# EAGLE design dontlook (EAGLE 5.07)
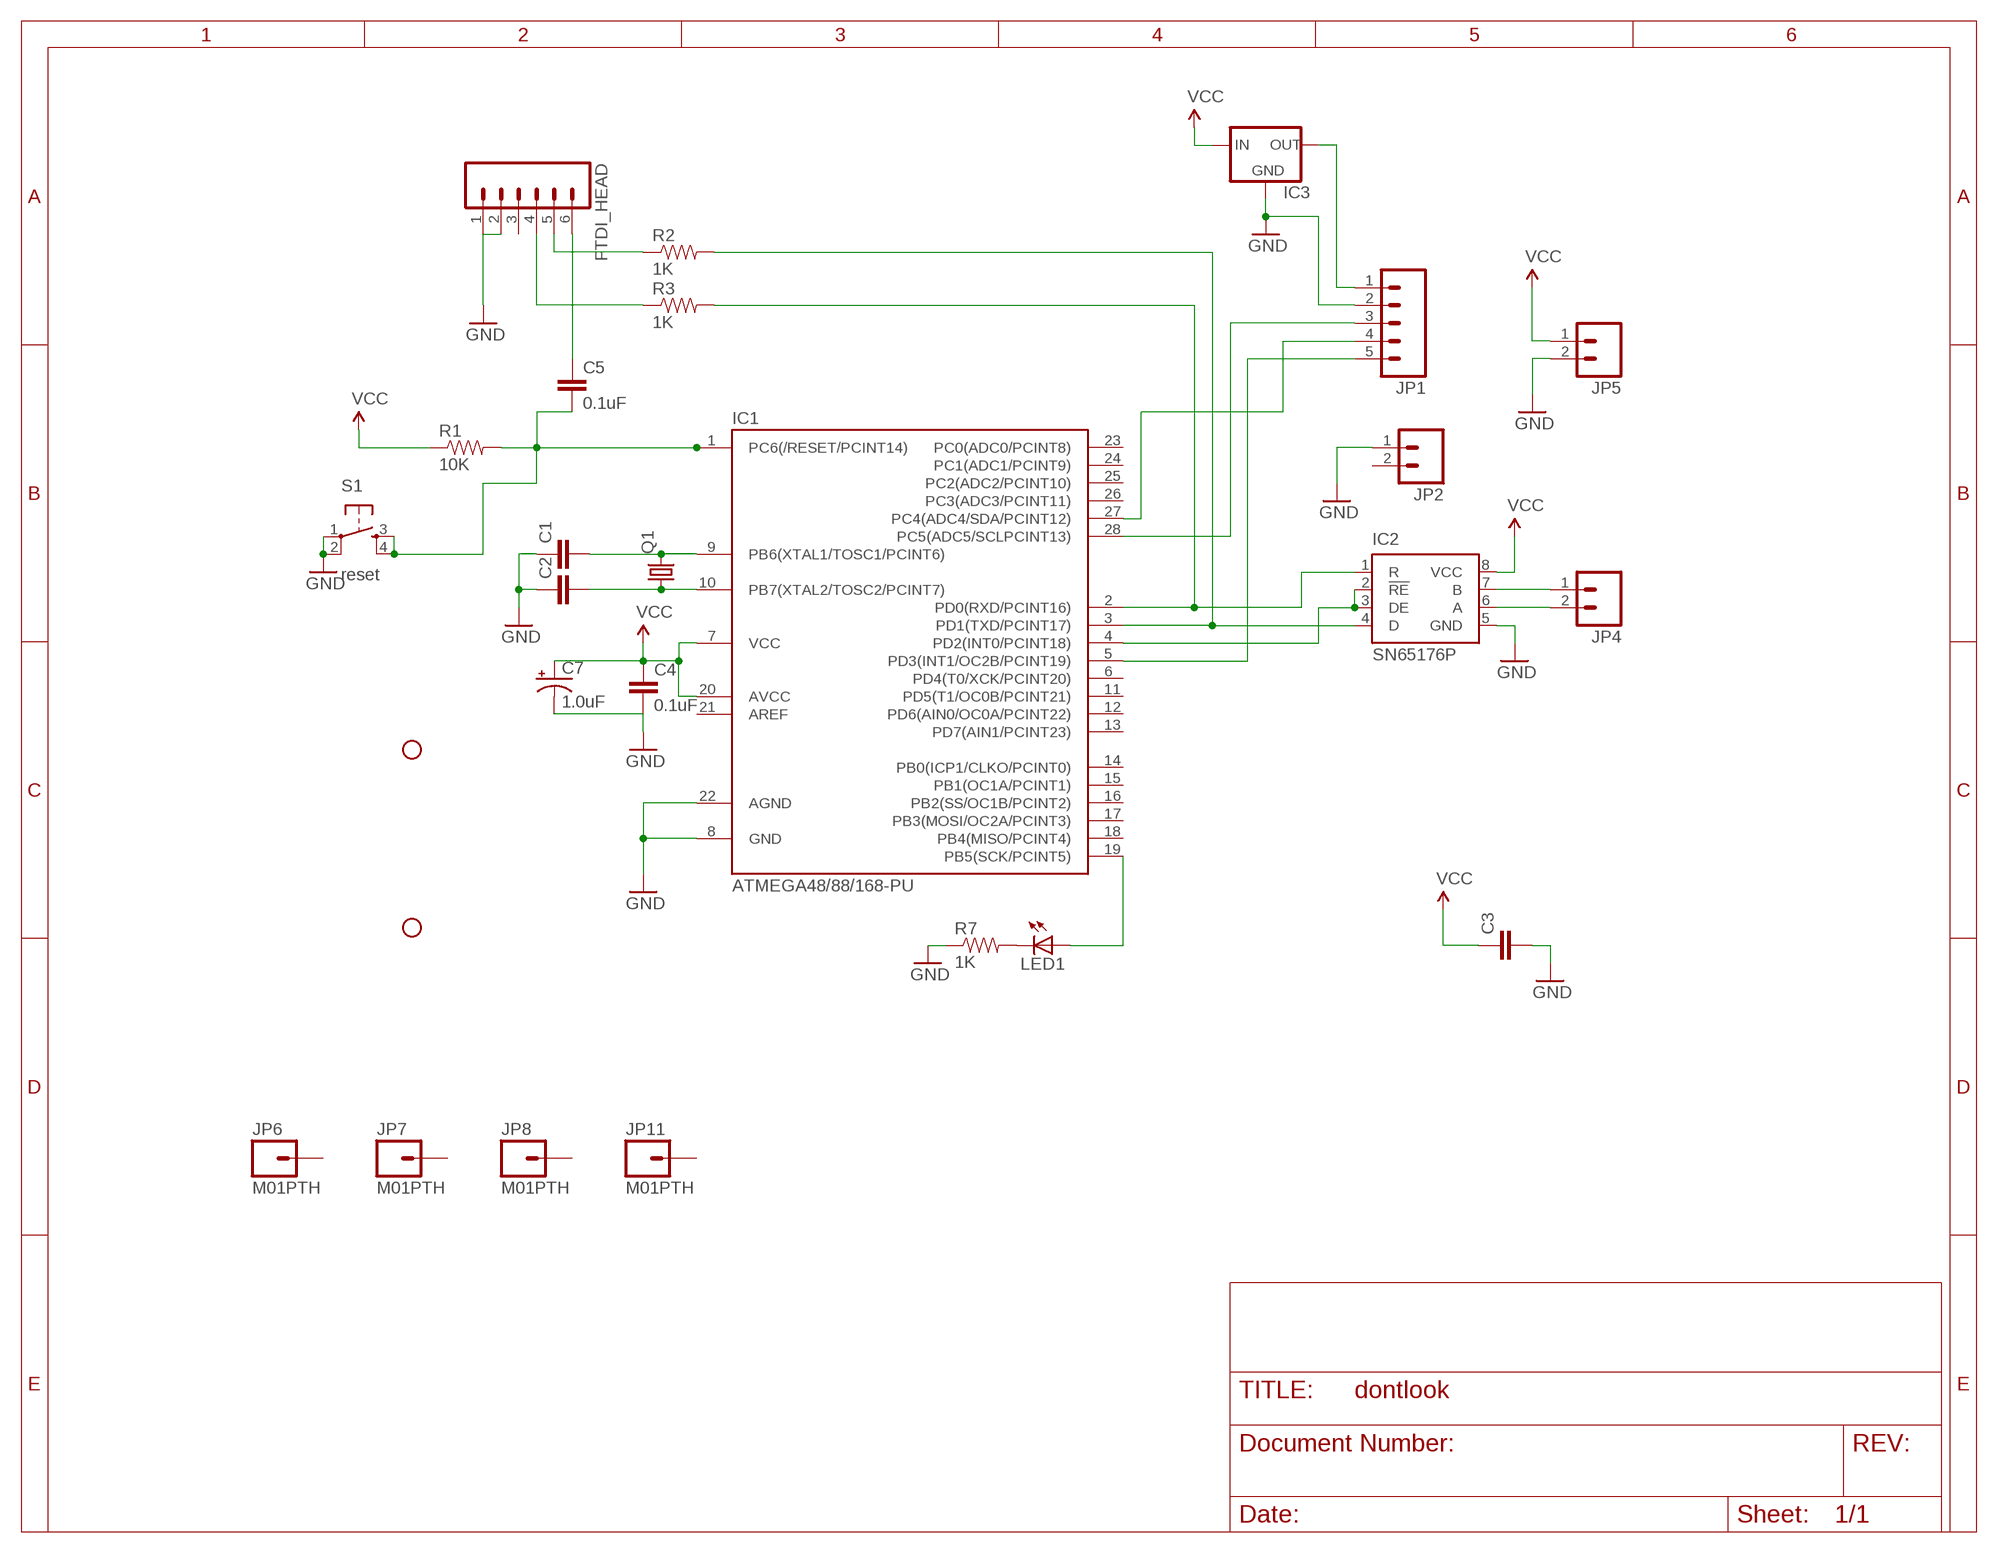
[diagram p0: schematic, sheet 1]

## Parts
C1  CAPPTH  [CAP-PTH-SMALL]
C2  CAPPTH  [CAP-PTH-SMALL]
C3  CAPPTH  [CAP-PTH-SMALL]
C4  0.1uF  CAPPTH  [CAP-PTH-SMALL]
C5  0.1uF  CAPPTH  [CAP-PTH-SMALL]
C7  1.0uF  CAP_POLPTH2  [CPOL-RADIAL-10UF-25V]
FTDI_HEAD  M06LOCK_LONGPADS  [1X06_LOCK_LONGPADS]
IC1  ATMEGA48/88/168-PU  [DIL28-3]
IC2  SN65176P  [DIL08]
IC3  78LXX  [78LXX]
JP1  M05LOCK_LONGPADS  [1X05_LOCK_LONGPADS]
JP2  M02LOCK_LONGPADS  [1X02_LOCK_LONGPADS]
JP4  M02PTH  [1X02]
JP5  M02PTH  [1X02]
JP6  M01PTH  [1X01]
JP7  M01PTH  [1X01]
JP8  M01PTH  [1X01]
JP9  STAND-OFF  [STAND-OFF]
JP10  STAND-OFF  [STAND-OFF]
JP11  M01PTH  [1X01]
LED1  LED5MM  [LED5MM]
Q1  CRYSTALHC49U-V  [HC49U-V]
R1  10K  RESISTORPTH1  [AXIAL-0.3]
R2  1K  RESISTORPTH1  [AXIAL-0.3]
R3  1K  RESISTORPTH1  [AXIAL-0.3]
R7  1K  RESISTORPTH1  [AXIAL-0.3]
S1  reset  TAC_SWITCHPTH  [TACTILE-PTH]

## Nets
GND: C1.1 C2.1 C3.2 C4.2 C7.2(-) FTDI_HEAD.1 FTDI_HEAD.2 IC1.8(GND) IC1.22(AGND) IC2.5(GND) IC3.GND JP1.2 JP2.1 JP5.2 R7.P$1 S1.1 S1.2
N$1: C1.2 IC1.9(PB6(XTAL1/TOSC1/PCINT6)) Q1.2
N$2: C2.2 IC1.10(PB7(XTAL2/TOSC2/PCINT7)) Q1.1
N$3: IC1.4(PD2(INT0/PCINT18)) IC2.2(!RE) IC2.3(DE)
N$4: IC3.OUT JP1.1
N$5: IC1.5(PD3(INT1/OC2B/PCINT19)) JP1.5
N$7: FTDI_HEAD.5 R2.P$1
N$9: C5.2 IC1.1(PC6(/RESET/PCINT14)) R1.P$2 S1.3 S1.4
N$10: IC1.28(PC5(ADC5/SCLPCINT13)) JP1.3
N$11: IC2.7(B) JP4.1
N$12: FTDI_HEAD.4 R3.P$1
N$13: IC1.3(PD1(TXD/PCINT17)) IC2.4(D) R2.P$2
N$14: IC2.6(A) JP4.2
N$15: IC1.2(PD0(RXD/PCINT16)) IC2.1(R) R3.P$2
N$17: IC1.27(PC4(ADC4/SDA/PCINT12)) JP1.4
N$19: C5.1 FTDI_HEAD.6
N$21: LED1.K(C) R7.P$2
N$24: IC1.19(PB5(SCK/PCINT5)) LED1.A
VCC: C3.1 C4.1 C7.1(+) IC1.7(VCC) IC1.20(AVCC) IC2.8(VCC) IC3.IN JP5.1 R1.P$1
Unconnected: FTDI_HEAD.3 IC1.6(PD4(T0/XCK/PCINT20)) IC1.11(PD5(T1/OC0B/PCINT21)) IC1.12(PD6(AIN0/OC0A/PCINT22)) IC1.13(PD7(AIN1/PCINT23)) IC1.14(PB0(ICP1/CLKO/PCINT0)) IC1.15(PB1(OC1A/PCINT1)) IC1.16(PB2(SS/OC1B/PCINT2)) IC1.17(PB3(MOSI/OC2A/PCINT3)) IC1.18(PB4(MISO/PCINT4)) IC1.21(AREF) IC1.23(PC0(ADC0/PCINT8)) IC1.24(PC1(ADC1/PCINT9)) IC1.25(PC2(ADC2/PCINT10)) IC1.26(PC3(ADC3/PCINT11)) JP2.2 JP6.1 JP7.1 JP8.1 JP11.1

## Library data of the parts
C1-C5 = SparkFun:CAP: Capacitor Standard 0603 ceramic capacitor, and 0.1" leaded capacitor.
C7 = SparkFun:CAP_POL: Capacitor Polarized These are standard SMD and PTH capacitors. Normally 10uF, 47uF, and 100uF in electrolytic and tantalum varieties. Always verify the external diameter of the through hole cap, it varies with capacity, voltage, and manufacturer. The EIA devices should be standard.
FTDI_HEAD = SparkFun:M06: Header 6 Standard 6-pin 0.1" header. Use with straight break away headers (SKU : PRT-00116), right angle break away headers (PRT-00553), swiss pins (PRT-00743), machine pins (PRT-00117), and female headers (PRT-00115). Molex polarized connector foot print use with SKU : PRT-08094 with associated crimp pins and housings. NOTES ON THE VARIANTS LOCK and LOCK_LONGPADS... This footprint was designed to help hold the alignment of a through-hole component (i.e. 6-pin header) while soldering it into place. You may notice that each hole has been shifted either up or down by 0.005 of an inch from it's more standard position (which is a perfectly straight line). This slight alteration caused the pins (the squares in the middle) to touch the edges of the holes. Because they are alternating, it causes a "brace" to hold the component in place. 0.005 has proven to be the perfect amount of "off-center" position when using our standard breakaway headers. Although looks a little odd when you look at the bare footprint, once you have a header in there, the alteration is very hard to notice. Also, if you push a header all the way into place, it is covered up entirely on the bottom side. This idea of altering the position of holes to aid alignment will be further integrated into the Sparkfun Library for other footprints. It can help hold any component with 3 or more connection pins.
IC1 = atmega8:ATMEGA48/88/168-PU
IC2 = texas:SN65176: DIFFERENTIAL BUS TRANSCEIVER Source: http://focus.ti.com .. sn65176b.pdf
IC3 = v-reg:78LXX: VOLTAGE REGULATOR
JP1 = SparkFun:M05: Header 5 Standard 5-pin 0.1" header. Use with straight break away headers (SKU : PRT-00116), right angle break away headers (PRT-00553), swiss pins (PRT-00743), machine pins (PRT-00117), and female headers (PRT-00115). Molex polarized connector foot print use with SKU : PRT-08230 with associated crimp pins and housings.
JP2 JP4 JP5 = SparkFun:M02: Header 2 Standard 2-pin 0.1" header. Use with straight break away headers (SKU : PRT-00116), right angle break away headers (PRT-00553), swiss pins (PRT-00743), machine pins (PRT-00117), and female headers (PRT-00115). Molex polarized connector foot print use with SKU : PRT-08233 with associated crimp pins and housings.
JP6-JP8 JP11 = SparkFun:M01: Header 1 Standard 1-pin 0.1" header. Use with straight break away headers (SKU : PRT-00116), right angle break away headers (PRT-00553), swiss pins (PRT-00743), machine pins (PRT-00117), and female headers (PRT-00115).
JP9 JP10 = SparkFun:STAND-OFF: Stand Off This is the mechanical footprint for a #4 phillips button head screw. Use the keepout ring to avoid running the screw head into surrounding components. SKU : PRT-00447
LED1 = SparkFun:LED: LEDs Standard schematic elements and footprints for 5mm, 3mm, 1206, and 0603 sized LEDs. 5mm - Spark Fun Electronics SKU : COM-00529 (and others)
Q1 = crystal:CRYSTAL: CRYSTAL
R1-R3 R7 = SparkFun:RESISTOR: Resistor Basic schematic elements and footprints for 0603, 1206, and PTH 1/10th watt (small) resistors.
S1 = SparkFun:TAC_SWITCH: Momentary Switch Button commonly used for reset or general input. Spark Fun Electronics SKU : COM-00097

## Net classes
0 signal: width 0.381 mm, drill 0.813 mm, clearance 0.254 mm
1 drive: width 1.778 mm, drill 0.813 mm, clearance 0.254 mm

## Board
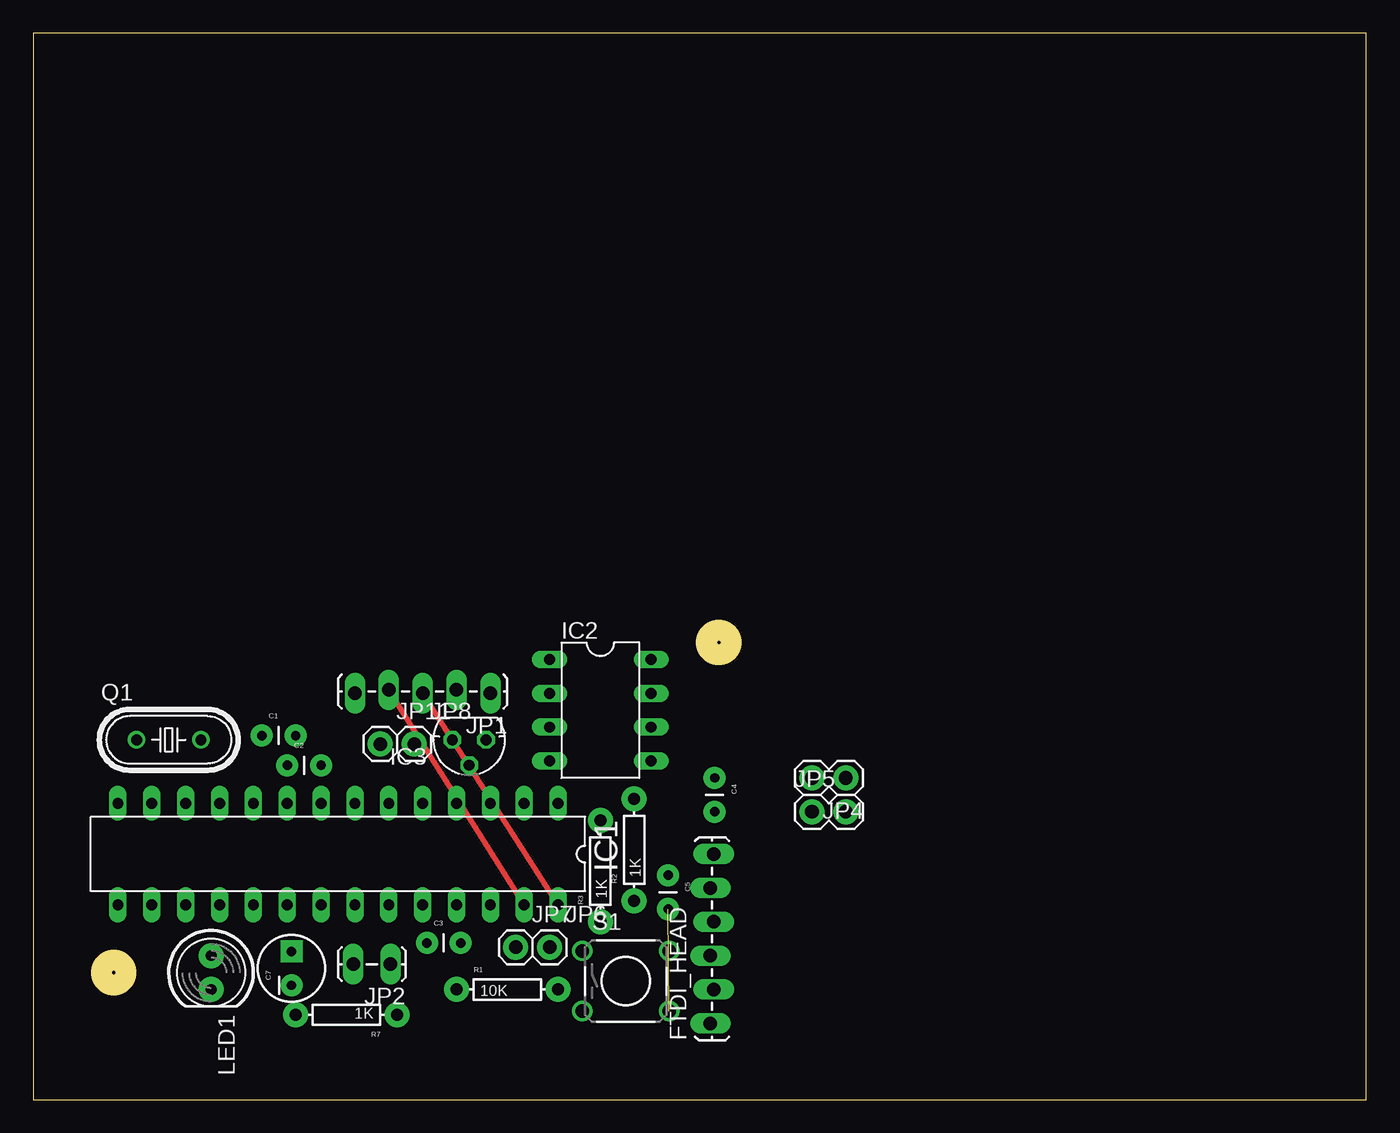
[diagram p1: board, top side]
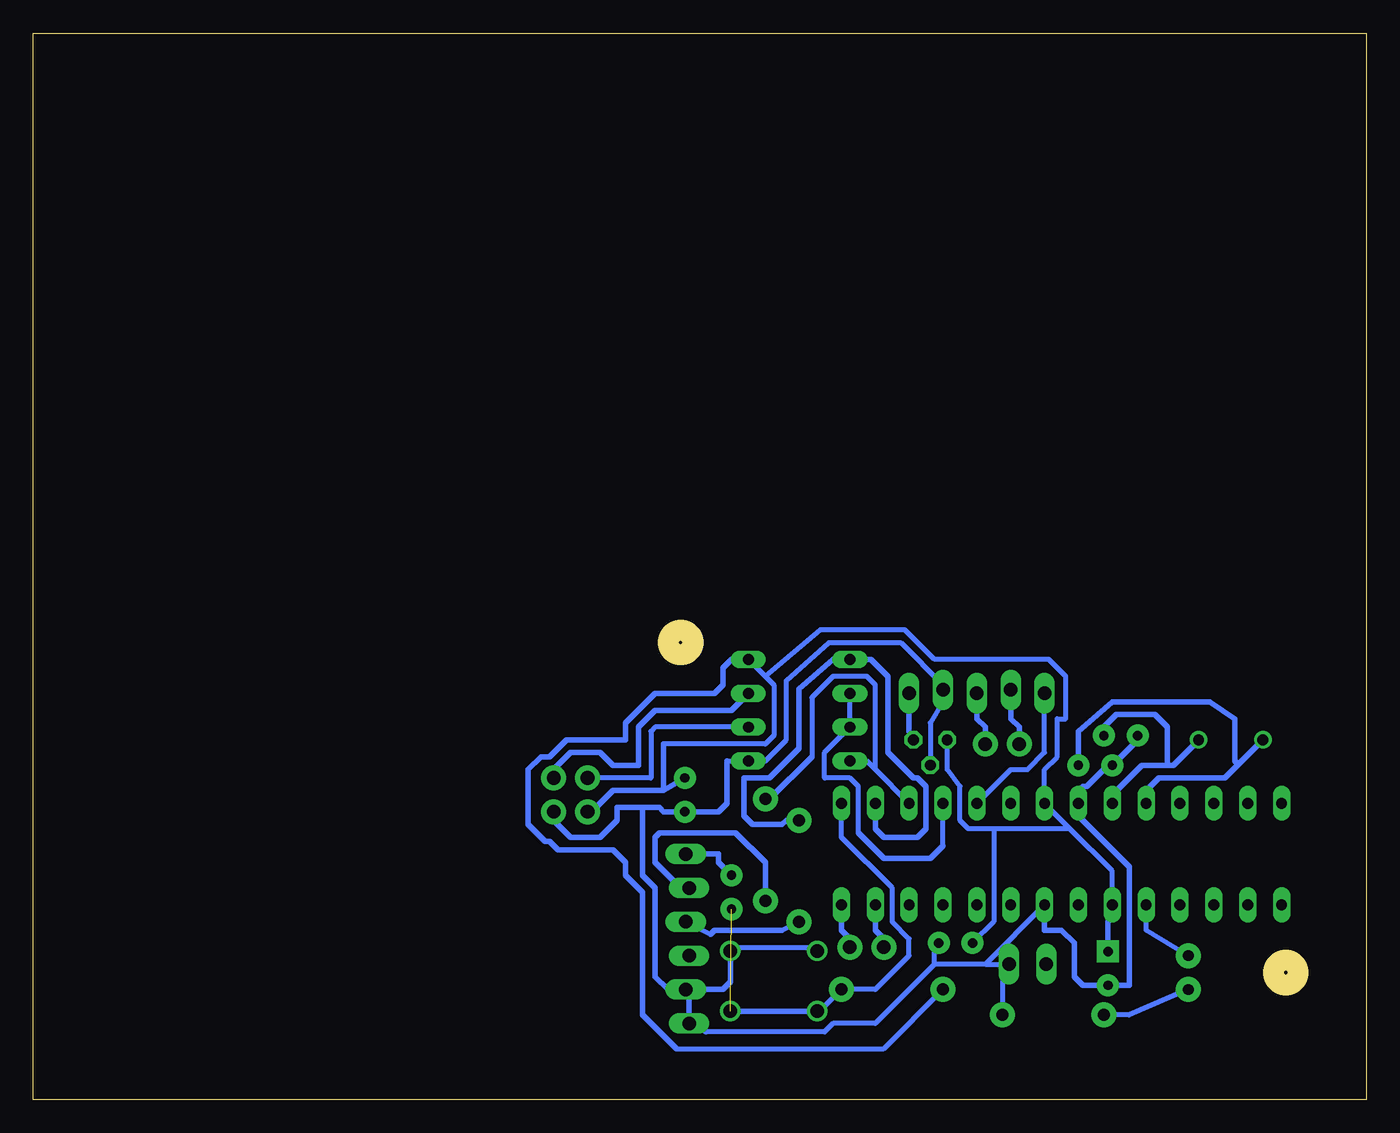
[diagram p2: board, bottom side, seen from below]

Size 100 x 80 mm. Coordinates in mm from the lower left corner, seen from the top.
Outline: 0,0 100,0 100,80 0,80 0,0
Copper layers (1*16): Top 0.035mm / dielectric 1.5mm / Bottom 0.035mm
Design rules "default *": minimum track width 15mil, minimum drill 24mil, track to track 15mil, track to pad 15mil, pad to pad 8mil, via to via 8mil, smd to smd 8mil, copper to edge 63mil, drill to drill 8mil, minimum pad ring 10mil, minimum via ring 8mil, stop-mask expansion 4mil, vias tented up to drill 0mil, thermal gap 10mil
Milling: area 50.5,33.4 to 52.3,35.2; area 5.1,8.6 to 6.9,10.4

### Footprints (pad centres in the part's own frame; a part is rotated, then mirrored left to right if it is on the bottom)
CAP-PTH-SMALL = drill 0.7 pad 1.651 round: 1 0,0; 2 2.54,0
CPOL-RADIAL-10UF-25V = drill 0.7 pad 1.651 square: 1 1.27,0 | drill 0.7 pad 1.651 round: 2 -1.27,0
1X06_LOCK_LONGPADS = drill 1.016 long: 1 0,0; 2 2.54,-0.254; 3 5.08,0; 4 7.62,-0.254; 5 10.16,0; 6 12.7,-0.254
DIL28-3 = drill 0.813 long: 1 -16.51,-3.81; 2 -13.97,-3.81; 3 -11.43,-3.81; 4 -8.89,-3.81; 5 -6.35,-3.81; 6 -3.81,-3.81; 7 -1.27,-3.81; 8 1.27,-3.81; 9 3.81,-3.81; 10 6.35,-3.81; 11 8.89,-3.81; 12 11.43,-3.81; 13 13.97,-3.81; 14 16.51,-3.81; 15 16.51,3.81; 16 13.97,3.81; 17 11.43,3.81; 18 8.89,3.81; 19 6.35,3.81; 20 3.81,3.81; 21 1.27,3.81; 22 -1.27,3.81; 23 -3.81,3.81; 24 -6.35,3.81; 25 -8.89,3.81; 26 -11.43,3.81; 27 -13.97,3.81; 28 -16.51,3.81
DIL08 = drill 0.813 long: 1 -3.81,-3.81; 2 -1.27,-3.81; 3 1.27,-3.81; 4 3.81,-3.81; 5 3.81,3.81; 6 1.27,3.81; 7 -1.27,3.81; 8 -3.81,3.81
78LXX = drill 0.813 octagon: GND 0,1.905; IN 1.27,0; OUT -1.27,0
1X05_LOCK_LONGPADS = drill 1.016 long: 1 0,0; 2 2.54,-0.254; 3 5.08,0; 4 7.62,-0.254; 5 10.16,0
1X02_LOCK_LONGPADS = drill 1.016 long: 1 -0.127,0; 2 2.667,0
1X02 = drill 1.016 pad 1.88 round: 1 0,0; 2 2.54,0
1X01 = drill 1.016 pad 1.88 round: 1 0,0
STAND-OFF = hole 3.302: 0,0
LED5MM = drill 0.813 pad 1.88 round: A -1.27,0; K 1.27,0
HC49U-V = drill 0.813 round: 1 -2.413,0; 2 2.413,0
AXIAL-0.3 = drill 0.9 pad 1.88 round: P$1 -3.81,0; P$2 3.81,0
TACTILE-PTH = drill 1.016 round: 1 -3.251,2.261; 2 3.251,2.261; 3 -3.251,-2.261; 4 3.251,-2.261

### Placement (x,y rotation side)
C1  17.14,27.3 0 top
C2  19.05,25.08 0 top
C3  29.53,11.75 0 top
C4  51.12,24.13 270 top
C5  47.62,16.83 270 top
C7  19.37,9.84 90 top
FTDI_HEAD  50.8,5.71 90 top
IC1  22.86,18.41 180 top
IC2  42.55,29.21 270 top
IC3  32.7,26.99 180 top
JP1  34.29,30.48 180 top
JP2  26.67,10.16 180 top
JP4  60.96,24.13 180 top
JP5  58.42,21.59 0 top
JP6  38.73,11.43 0 top
JP7  36.2,11.43 0 top
JP8  28.57,26.67 0 top
JP9  6.03,9.53 0 top
JP10  51.44,34.29 0 top
JP11  26.04,26.67 0 top
LED1  13.34,9.53 270 top
Q1  10.16,26.99 0 top
R1  35.56,8.26 0 top
R2  45.09,18.73 90 top
R3  42.55,17.14 90 top
R7  23.5,6.35 180 top
S1  44.45,8.89 0 top

### Tracks (layer width: path | path; a pad name or v marks a point on that pad's centre or on a via)
GND
  Bottom 0.381: 28.57,10.16 27.3,10.16 | 28.57,10.16 32.38,10.16 | 27.3,10.16 R7.P$1 | 27.3,10.16 JP2.1 | IC3.GND 32.7,28.26 31.75,29.84 JP1.2 31.75,31.11 34.92,34.29 40.32,34.29 43.5,31.43 43.5,26.99 45.09,25.4 IC2.5 47.94,25.4 | S1.1 41.27,11.43 47.62,11.43 S1.2 | 49.53,5.08 40.64,5.08 40.01,5.71 36.83,5.71 32.38,10.16 | 32.38,10.16 32.38,11.43 C3.2 | IC1.22 28.57,10.16
  Bottom 0.406: JP5.2 60.96,20.95 59.69,19.68 57.47,19.68 56.2,20.95 56.2,21.91 54.29,21.91 | 47.94,25.4 47.94,22.23 48.58,21.59 C4.2 52.7,21.59 53.02,21.91 54.29,21.91 | C1.1 17.14,26.99 C2.1 19.37,25.08 20.95,23.5 21.27,23.5 21.59,23.18 IC1.8 21.59,21.27 17.78,17.46 17.78,8.57 C7.2 21.27,8.57 21.91,9.21 21.91,11.75 22.86,12.7 24.13,12.7 IC1.22 | S1.2 47.7,8.81 48.26,8.26 FTDI_HEAD.2 | FTDI_HEAD.2 52.39,8.26 53.34,9.21 53.34,15.88 54.29,16.83 54.29,21.91 | 49.53,5.08 50.16,5.71 FTDI_HEAD.1 50.8,8 FTDI_HEAD.2
N$1
  Bottom 0.406: IC1.9 19.05,22.86 16.83,25.08 14.92,25.08 | Q1.2 14.48,25.08 14.92,25.08 | C1.2 19.68,27.94 18.73,28.89 15.88,28.89 14.92,27.94 14.92,25.08
N$2
  Bottom 0.406: IC1.10 16.51,23.18 15.56,24.13 10.6,24.13 9.59,25.15 | 9.59,25.15 Q1.1 | C2.2 21.59,27.62 19.05,29.84 11.75,29.84 9.84,28.57 9.84,25.4 9.59,25.15
N$3
  Bottom 0.381: 31.75,19.05 IC1.4 | 38.1,20 38.1,23.5 38.73,24.13 40.64,24.13 40.64,26.04 IC2.3 IC2.2
  Bottom 0.406: 38.1,20 36.2,18.1 32.7,18.1 31.75,19.05
N$4
  Bottom 0.406: IC3.OUT 33.97,27.3 34.29,27.62 JP1.1
N$5
  Bottom 0.381: IC1.5 26.67,24.77 25.4,24.77 24.13,26.04 JP1.5
N$6
  Bottom 0.406: 36.2,12.06 36.83,12.7 36.83,13.97
N$7
  Bottom 0.406: FTDI_HEAD.5 51.44,15.88 53.34,17.78 53.34,19.68 53.02,20 47.31,20 45.09,17.78 R2.P$1
N$8
  Bottom 0.406: 38.73,12.06 39.37,12.7 39.37,13.97
N$9  (1 unrouted)
  Bottom 0.381: IC1.1 39.37,19.68 35.56,15.88 35.56,13.34 34.29,12.06 34.29,10.79 36.83,8.26 R1.P$2 40.64,6.99 S1.3
  Bottom 0.406: S1.3 S1.4
N$10
  Top 0.406: IC1.28 JP1.3
N$11
  Bottom 0.406: JP4.1 60.96,24.77 59.69,26.04 57.47,26.04 56.52,25.08 54.61,25.08 54.61,27.94 53.34,29.21 47.62,29.21 IC2.7
N$12
  Bottom 0.406: R3.P$1 43.81,12.7 48.9,12.7 49.21,12.38 FTDI_HEAD.4
N$13
  Bottom 0.381: 36.83,24.77 37.47,25.4 IC2.4 | IC1.3 36.83,24.77 | 41.59,25.72 41.59,30.16 40.01,31.75 37.47,31.75 36.83,31.11 36.83,24.77
  Bottom 0.406: R2.P$2 44.77,22.54 41.59,25.72
N$14
  Bottom 0.381: IC2.6 53.34,27.94 53.66,27.62 53.66,24.13 JP4.2
N$15
  Bottom 0.406: IC1.2 36.83,20.32 36.2,19.68 33.66,19.68 33.02,20.32 33.02,23.5 33.66,24.13 33.97,24.13 35.88,26.04 35.88,31.75 37.15,33.02 IC2.1 40.01,33.02 42.55,30.8 42.55,26.35 44.77,24.13 46.67,24.13 46.67,21.27 46.04,20.64 43.81,20.64 43.5,20.95 R3.P$2
N$16
  Bottom 0.406: 29.21,29.84 29.21,28.57 28.57,27.94 28.57,27.3
N$17
  Top 0.406: IC1.27 JP1.4
N$18
  Bottom 0.406: 26.67,29.84 26.67,28.57 26.04,27.94 26.04,27.3
N$19
  Bottom 0.406: FTDI_HEAD.6 48.58,18.41 48.58,17.78 C5.1
N$21
  Bottom 0.381: R7.P$2 17.78,6.35 LED1.K
N$24
  Bottom 0.381: IC1.19 16.51,12.7 LED1.A
VCC
  Bottom 0.381: IC1.20 19.05,17.14 22.23,20.32 | 22.23,20.32 IC1.7 24.13,24.77 23.18,25.72 23.18,28.57 22.54,28.57 22.54,31.75 23.81,33.02 32.38,33.02 34.61,35.24 40.96,35.24 45.09,31.75 | IC3.IN 31.43,24.77 30.48,23.5 30.48,20.95 29.84,20.32 27.94,20.32 | 22.23,20.32 27.94,20.32 | 45.09,31.75 IC2.8 | 45.09,31.75 44.45,31.11 44.45,27.3 45.09,26.67 52.7,26.67 | 51.75,3.81 36.2,3.81 R1.P$1 | 27.94,20.32 27.94,13.34 C3.1
  Bottom 0.406: JP5.1 58.1,21.59 56.52,23.18 52.7,23.18 | 51.75,3.81 54.29,6.35 54.29,15.56 55.56,16.83 55.56,17.78 56.52,18.73 60.64,18.73 61.28,19.37 61.59,19.37 62.87,20.64 62.87,24.77 61.91,25.72 61.28,25.72 60.01,26.99 55.56,26.99 55.56,28.26 53.34,30.48 48.9,30.48 48.26,31.11 48.26,32.38 47.62,33.02 IC2.8 | 52.7,23.18 C4.1 | 52.7,26.67 52.7,23.18 | IC1.20 19.05,13.65 19.37,13.34 C7.1